# Altium schematic sheet TUN7_Main.SchDoc
size 594 x 420 mm; Author: RU4PN; CompanyName: Wolf Team; DocumentNumber: W2 - Tuner - Main; SheetNumber: 2; SheetTotal: 2
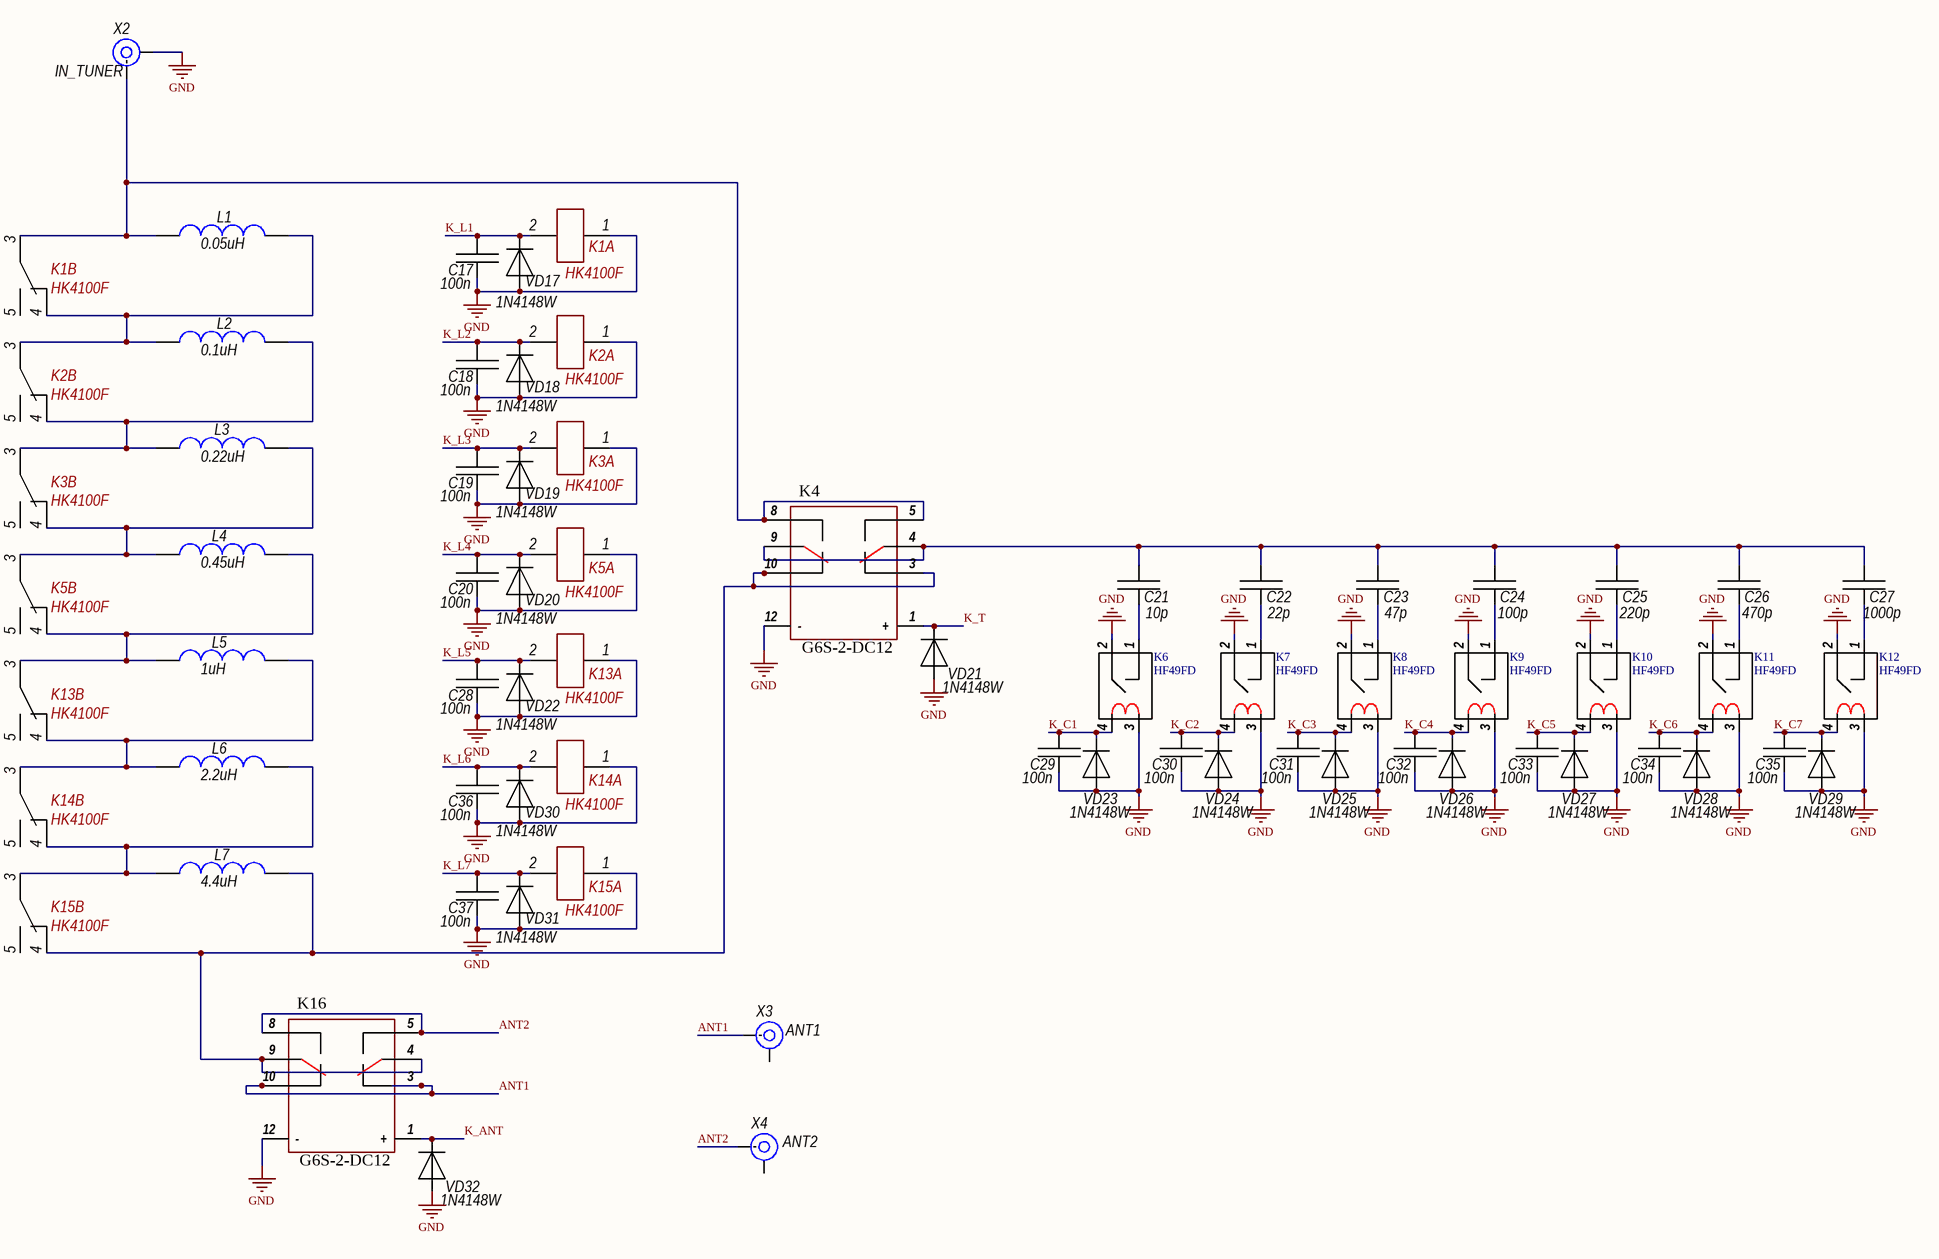
[diagram p0: TUN7_Main.SchDoc]

## Parts
C17  100n  [CH0805C]
C18  100n  [CH0805C]
C19  100n  [CH0805C]
C20  100n  [CH0805C]
C21  10p  [CH1206ATC]
C22  22p  [CH1206ATC]
C23  47p  [CH1206ATC]
C24  100p  [CH1206ATC]
C25  220p  [CH1206ATC]
C26  470p  [CH1206ATC]
C27  1000p  [CH1206ATC]
C28  100n  [CH0805C]
C29  100n  [CH0805C]
C30  100n  [CH0805C]
C31  100n  [CH0805C]
C32  100n  [CH0805C]
C33  100n  [CH0805C]
C34  100n  [CH0805C]
C35  100n  [CH0805C]
C36  100n  [CH0805C]
C37  100n  [CH0805C]
K1  HK4100F  [NK4100F]  (parts A,B of 2)
K2  HK4100F  [NK4100F]  (parts A,B of 2)
K3  HK4100F  [NK4100F]  (parts A,B of 2)
K4  G6S-2-DC12  [G6S-2-DC12]
K5  HK4100F  [NK4100F]  (parts A,B of 2)
K6  HF49FD  [HF49FD]
K7  HF49FD  [HF49FD]
K8  HF49FD  [HF49FD]
K9  HF49FD  [HF49FD]
K10  HF49FD  [HF49FD]
K11  HF49FD  [HF49FD]
K12  HF49FD  [HF49FD]
K13  HK4100F  [NK4100F]  (parts A,B of 2)
K14  HK4100F  [NK4100F]  (parts A,B of 2)
K15  HK4100F  [NK4100F]  (parts A,B of 2)
K16  G6S-2-DC12  [G6S-2-DC12]
L1  0.05uH  [DR1]
L2  0.1uH  [DR1]
L3  0.22uH  [DR1]
L4  0.45uH  [T68-0]
L5  1uH  [T68-0]
L6  2.2uH  [T68-0]
L7  4.4uH  [T68-0]
VD17  1N4148W  [SOD123]
VD18  1N4148W  [SOD123]
VD19  1N4148W  [SOD123]
VD20  1N4148W  [SOD123]
VD21  1N4148W  [SOD123]
VD22  1N4148W  [SOD123]
VD23  1N4148W  [SOD123]
VD24  1N4148W  [SOD123]
VD25  1N4148W  [SOD123]
VD26  1N4148W  [SOD123]
VD27  1N4148W  [SOD123]
VD28  1N4148W  [SOD123]
VD29  1N4148W  [SOD123]
VD30  1N4148W  [SOD123]
VD31  1N4148W  [SOD123]
VD32  1N4148W  [SOD123]
X2  IN_TUNER  [CON: SMA]
X3  ANT1  [CON: SMA]
X4  ANT2  [CON: SMA]

## Nets
GND: C17.2 C18.2 C19.2 C20.2 C28.2 C29.2 C30.2 C31.2 C32.2 C33.2 C34.2 C35.2 C36.2 C37.2 K1.1 K2.1 K3.1 K4.12(-) K5.1 K6.2 K6.3 K7.2 K7.3 K8.2 K8.3 K9.2 K9.3 K10.2 K10.3 K11.2 K11.3 K12.2 K12.3 K13.1 K14.1 K15.1 K16.12(-) VD17.1 VD18.1 VD19.1 VD20.1 VD21.1 VD22.1 VD23.1 VD24.1 VD25.1 VD26.1 VD27.1 VD28.1 VD29.1 VD30.1 VD31.1 VD32.1 X2.2(IN)
ANT1: K16.3(NC_1) K16.10(NC_2) X3.1(IN)
ANT2: K16.5(NO_1) K16.8(NO_2) X4.1(IN)
K_ANT: K16.1(+) VD32.2
K_C1: C29.1 K6.4 VD23.2
K_C2: C30.1 K7.4 VD24.2
K_C3: C31.1 K8.4 VD25.2
K_C4: C32.1 K9.4 VD26.2
K_C5: C33.1 K10.4 VD27.2
K_C6: C34.1 K11.4 VD28.2
K_C7: C35.1 K12.4 VD29.2
K_L1: C17.1 K1.2 VD17.2
K_L2: C18.1 K2.2 VD18.2
K_L3: C19.1 K3.2 VD19.2
K_L4: C20.1 K5.2 VD20.2
K_L5: C28.1 K13.2 VD22.2
K_L6: C36.1 K14.2 VD30.2
K_L7: C37.1 K15.2 VD31.2
K_T: K4.1(+) VD21.2
NetC21_1: C21.1 C22.1 C23.1 C24.1 C25.1 C26.1 C27.1 K4.4(COM_1) K4.9(COM_2)
NetC21_2: C21.2 K6.1
NetC22_2: C22.2 K7.1
NetC23_2: C23.2 K8.1
NetC24_2: C24.2 K9.1
NetC25_2: C25.2 K10.1
NetC26_2: C26.2 K11.1
NetC27_2: C27.2 K12.1
NetK1_3: K1.3 K4.5(NO_1) K4.8(NO_2) L1.2 X2.1(IN)
NetK1_4: K1.4 K2.3 L1.1 L2.2
NetK2_4: K2.4 K3.3 L2.1 L3.2
NetK3_4: K3.4 K5.3 L3.1 L4.2
NetK4_3: K4.3(NC_1) K4.10(NC_2) K15.4 K16.4(COM_1) K16.9(COM_2) L7.1
NetK5_4: K5.4 K13.3 L4.1 L5.2
NetK13_4: K13.4 K14.3 L5.1 L6.2
NetK14_4: K14.4 K15.3 L6.1 L7.2

Not connected (* = marked no-connect by the designer): K1 5; K2 5; K3 5; K5 5; K13 5; K14 5; K15 5; X3 2(IN); X4 2(IN)

## Notes on the sheet
- Перв. примен.
- Справ. №
- Подп. и дата
- Инв. № дубл.
- Взам. инв. №
- Инв. № подл.
- Изм.
- Лист
- № докум.
- Подп.
- Дата
- 2.106-A2
- Копировал
- Формат А2

## Library data of the parts
C17-C37 = Capacitor: Manufacturer: *; Model: *; HelpURL: *; ComponentKind: *; Value: *
K1-K3 K5 K13-K15 = NK4100F
K4 K16 = G6S-2-DC12V_2
K6-K12 = HF49FD 012-1H12
L1-L7 = Inductor ring: Value: {Value}; Model: *; ComponentKind: *; Manufacturer: *; HelpURL: *
VD17-VD32 = Diod: ComponentKind: *; Manufacturer: *; Model: *; HelpURL: *
X2-X4 = SMA: RF; Model: *; Manufacturer: *; HelpURL: *; ComponentKind: *